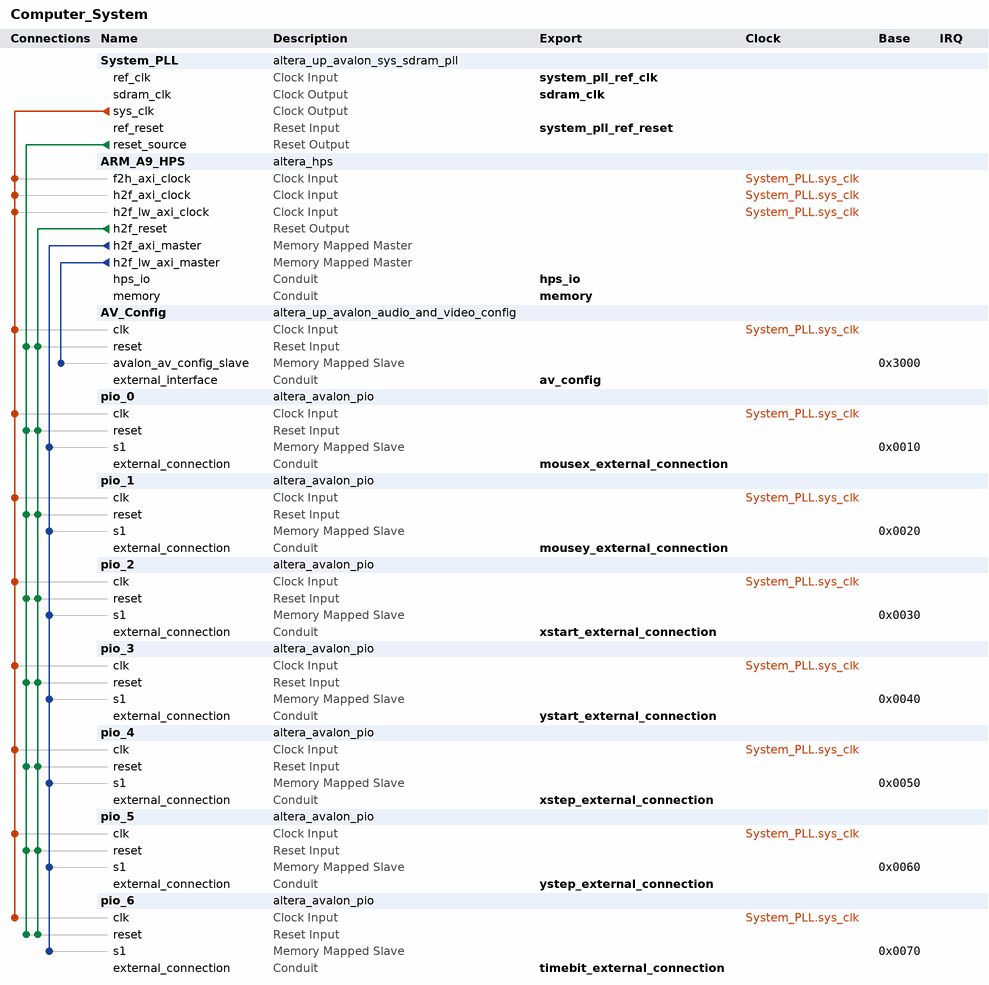
[diagram p0: system contents]
# Platform Designer (Qsys) system Computer_System, Cyclone V 5CSEMA5F31C6
# Parameters at their usual value, and those the tool derives, are not listed.
package require -exact qsys 15.0
create_system Computer_System
set_project_property DEVICE_FAMILY {Cyclone V}
set_project_property DEVICE 5CSEMA5F31C6

add_instance System_PLL altera_up_avalon_sys_sdram_pll 15.0
set_instance_parameter_value System_PLL CV_boards DE1-SoC
set_instance_parameter_value System_PLL gui_outclk 100.0
set_instance_parameter_value System_PLL gui_refclk 50.0

add_instance ARM_A9_HPS altera_hps 15.0
set_instance_parameter_value ARM_A9_HPS EMAC1_Mode RGMII
set_instance_parameter_value ARM_A9_HPS EMAC1_PinMuxing {HPS I/O Set 0}
set_instance_parameter_value ARM_A9_HPS F2SCLK_COLDRST_Enable false
set_instance_parameter_value ARM_A9_HPS F2SCLK_DBGRST_Enable false
set_instance_parameter_value ARM_A9_HPS F2SCLK_WARMRST_Enable false
set_instance_parameter_value ARM_A9_HPS F2SINTERRUPT_Enable true
set_instance_parameter_value ARM_A9_HPS F2S_Width 2
set_instance_parameter_value ARM_A9_HPS FPGA_PERIPHERAL_OUTPUT_CLOCK_FREQ_EMAC0_GTX_CLK 125
set_instance_parameter_value ARM_A9_HPS FPGA_PERIPHERAL_OUTPUT_CLOCK_FREQ_EMAC0_MD_CLK 100.0
set_instance_parameter_value ARM_A9_HPS FPGA_PERIPHERAL_OUTPUT_CLOCK_FREQ_EMAC1_GTX_CLK 125
set_instance_parameter_value ARM_A9_HPS FPGA_PERIPHERAL_OUTPUT_CLOCK_FREQ_EMAC1_MD_CLK 100.0
set_instance_parameter_value ARM_A9_HPS HPS_PROTOCOL DDR3
set_instance_parameter_value ARM_A9_HPS I2C0_Mode I2C
set_instance_parameter_value ARM_A9_HPS I2C0_PinMuxing {HPS I/O Set 0}
set_instance_parameter_value ARM_A9_HPS I2C1_Mode I2C
set_instance_parameter_value ARM_A9_HPS I2C1_PinMuxing {HPS I/O Set 0}
set_instance_parameter_value ARM_A9_HPS LWH2F_Enable true
set_instance_parameter_value ARM_A9_HPS MEM_BANKADDR_WIDTH 3
set_instance_parameter_value ARM_A9_HPS MEM_CLK_FREQ 400.0
set_instance_parameter_value ARM_A9_HPS MEM_COL_ADDR_WIDTH 10
set_instance_parameter_value ARM_A9_HPS MEM_DQ_WIDTH 32
set_instance_parameter_value ARM_A9_HPS MEM_DRV_STR RZQ/7
set_instance_parameter_value ARM_A9_HPS MEM_ROW_ADDR_WIDTH 15
set_instance_parameter_value ARM_A9_HPS MEM_RTT_NOM RZQ/4
set_instance_parameter_value ARM_A9_HPS MEM_RTT_WR RZQ/4
set_instance_parameter_value ARM_A9_HPS MEM_TCL 11
set_instance_parameter_value ARM_A9_HPS MEM_TFAW_NS 30.0
set_instance_parameter_value ARM_A9_HPS MEM_TRAS_NS 35.0
set_instance_parameter_value ARM_A9_HPS MEM_TRCD_NS 13.75
set_instance_parameter_value ARM_A9_HPS MEM_TRFC_NS 260.0
set_instance_parameter_value ARM_A9_HPS MEM_TRP_NS 13.75
set_instance_parameter_value ARM_A9_HPS MEM_VENDOR JEDEC
set_instance_parameter_value ARM_A9_HPS MEM_WTCL 8
set_instance_parameter_value ARM_A9_HPS QSPI_Mode {1 SS}
set_instance_parameter_value ARM_A9_HPS QSPI_PinMuxing {HPS I/O Set 0}
set_instance_parameter_value ARM_A9_HPS REF_CLK_FREQ 25.0
set_instance_parameter_value ARM_A9_HPS S2F_Width 3
set_instance_parameter_value ARM_A9_HPS SDIO_Mode {4-bit Data}
set_instance_parameter_value ARM_A9_HPS SDIO_PinMuxing {HPS I/O Set 0}
set_instance_parameter_value ARM_A9_HPS SPIM1_Mode {Single Slave Select}
set_instance_parameter_value ARM_A9_HPS SPIM1_PinMuxing {HPS I/O Set 0}
set_instance_parameter_value ARM_A9_HPS STM_Enable false
set_instance_parameter_value ARM_A9_HPS TIMING_BOARD_AC_SKEW 0.03
set_instance_parameter_value ARM_A9_HPS TIMING_BOARD_AC_TO_CK_SKEW 0.0
set_instance_parameter_value ARM_A9_HPS TIMING_BOARD_DQ_TO_DQS_SKEW 0.0
set_instance_parameter_value ARM_A9_HPS TIMING_BOARD_MAX_CK_DELAY 0.03
set_instance_parameter_value ARM_A9_HPS TIMING_BOARD_MAX_DQS_DELAY 0.02
set_instance_parameter_value ARM_A9_HPS TIMING_BOARD_SKEW_BETWEEN_DQS 0.08
set_instance_parameter_value ARM_A9_HPS TIMING_BOARD_SKEW_CKDQS_DIMM_MAX 0.16
set_instance_parameter_value ARM_A9_HPS TIMING_BOARD_SKEW_CKDQS_DIMM_MIN 0.09
set_instance_parameter_value ARM_A9_HPS TIMING_BOARD_SKEW_WITHIN_DQS 0.01
set_instance_parameter_value ARM_A9_HPS TIMING_TDH 65
set_instance_parameter_value ARM_A9_HPS TIMING_TDQSCK 255
set_instance_parameter_value ARM_A9_HPS TIMING_TDQSQ 125
set_instance_parameter_value ARM_A9_HPS TIMING_TDS 30
set_instance_parameter_value ARM_A9_HPS TIMING_TIH 140
set_instance_parameter_value ARM_A9_HPS TIMING_TIS 180
set_instance_parameter_value ARM_A9_HPS TIMING_TQSH 0.4
set_instance_parameter_value ARM_A9_HPS UART0_Mode {No Flow Control}
set_instance_parameter_value ARM_A9_HPS UART0_PinMuxing {HPS I/O Set 0}
set_instance_parameter_value ARM_A9_HPS USB1_Mode SDR
set_instance_parameter_value ARM_A9_HPS USB1_PinMuxing {HPS I/O Set 0}
set_instance_parameter_value ARM_A9_HPS desired_cfg_clk_mhz 100.0
set_instance_parameter_value ARM_A9_HPS desired_qspi_clk_mhz 400.0

add_instance AV_Config altera_up_avalon_audio_and_video_config 15.0
set_instance_parameter_value AV_Config audio_in {Microphone to ADC}
set_instance_parameter_value AV_Config bit_length 32
set_instance_parameter_value AV_Config board DE1-SoC
set_instance_parameter_value AV_Config line_in_bypass false
set_instance_parameter_value AV_Config sampling_rate {48 kHz}

add_instance pio_0 altera_avalon_pio 15.0
set_instance_parameter_value pio_0 direction Output
set_instance_parameter_value pio_0 resetValue 319
set_instance_parameter_value pio_0 width 10

add_instance pio_1 altera_avalon_pio 15.0
set_instance_parameter_value pio_1 direction Output
set_instance_parameter_value pio_1 resetValue 239
set_instance_parameter_value pio_1 width 10

add_instance pio_2 altera_avalon_pio 15.0
set_instance_parameter_value pio_2 direction Output
set_instance_parameter_value pio_2 resetValue 117440512
set_instance_parameter_value pio_2 width 27

add_instance pio_3 altera_avalon_pio 15.0
set_instance_parameter_value pio_3 direction Output
set_instance_parameter_value pio_3 resetValue 125829120
set_instance_parameter_value pio_3 width 27

add_instance pio_4 altera_avalon_pio 15.0
set_instance_parameter_value pio_4 direction Output
set_instance_parameter_value pio_4 resetValue 39383
set_instance_parameter_value pio_4 width 27

add_instance pio_5 altera_avalon_pio 15.0
set_instance_parameter_value pio_5 direction Output
set_instance_parameter_value pio_5 resetValue 35025
set_instance_parameter_value pio_5 width 27

add_instance pio_6 altera_avalon_pio 15.0
set_instance_parameter_value pio_6 direction Input
set_instance_parameter_value pio_6 width 1

# connections
add_connection System_PLL.sys_clk ARM_A9_HPS.f2h_axi_clock clock
add_connection System_PLL.sys_clk ARM_A9_HPS.h2f_axi_clock clock
add_connection System_PLL.sys_clk ARM_A9_HPS.h2f_lw_axi_clock clock
add_connection System_PLL.sys_clk AV_Config.clk clock
add_connection System_PLL.sys_clk pio_0.clk clock
add_connection System_PLL.sys_clk pio_1.clk clock
add_connection System_PLL.sys_clk pio_2.clk clock
add_connection System_PLL.sys_clk pio_3.clk clock
add_connection System_PLL.sys_clk pio_4.clk clock
add_connection System_PLL.sys_clk pio_5.clk clock
add_connection System_PLL.sys_clk pio_6.clk clock
add_connection ARM_A9_HPS.h2f_reset AV_Config.reset reset
add_connection ARM_A9_HPS.h2f_reset pio_0.reset reset
add_connection ARM_A9_HPS.h2f_reset pio_1.reset reset
add_connection ARM_A9_HPS.h2f_reset pio_2.reset reset
add_connection ARM_A9_HPS.h2f_reset pio_3.reset reset
add_connection ARM_A9_HPS.h2f_reset pio_4.reset reset
add_connection ARM_A9_HPS.h2f_reset pio_5.reset reset
add_connection ARM_A9_HPS.h2f_reset pio_6.reset reset
add_connection System_PLL.reset_source AV_Config.reset reset
add_connection System_PLL.reset_source pio_0.reset reset
add_connection System_PLL.reset_source pio_1.reset reset
add_connection System_PLL.reset_source pio_2.reset reset
add_connection System_PLL.reset_source pio_3.reset reset
add_connection System_PLL.reset_source pio_4.reset reset
add_connection System_PLL.reset_source pio_5.reset reset
add_connection System_PLL.reset_source pio_6.reset reset
add_connection ARM_A9_HPS.h2f_axi_master pio_0.s1 avalon
set_connection_parameter_value ARM_A9_HPS.h2f_axi_master/pio_0.s1 baseAddress 0x0010
add_connection ARM_A9_HPS.h2f_axi_master pio_1.s1 avalon
set_connection_parameter_value ARM_A9_HPS.h2f_axi_master/pio_1.s1 baseAddress 0x0020
add_connection ARM_A9_HPS.h2f_axi_master pio_2.s1 avalon
set_connection_parameter_value ARM_A9_HPS.h2f_axi_master/pio_2.s1 baseAddress 0x0030
add_connection ARM_A9_HPS.h2f_axi_master pio_3.s1 avalon
set_connection_parameter_value ARM_A9_HPS.h2f_axi_master/pio_3.s1 baseAddress 0x0040
add_connection ARM_A9_HPS.h2f_axi_master pio_4.s1 avalon
set_connection_parameter_value ARM_A9_HPS.h2f_axi_master/pio_4.s1 baseAddress 0x0050
add_connection ARM_A9_HPS.h2f_axi_master pio_5.s1 avalon
set_connection_parameter_value ARM_A9_HPS.h2f_axi_master/pio_5.s1 baseAddress 0x0060
add_connection ARM_A9_HPS.h2f_axi_master pio_6.s1 avalon
set_connection_parameter_value ARM_A9_HPS.h2f_axi_master/pio_6.s1 baseAddress 0x0070
add_connection ARM_A9_HPS.h2f_lw_axi_master AV_Config.avalon_av_config_slave avalon
set_connection_parameter_value ARM_A9_HPS.h2f_lw_axi_master/AV_Config.avalon_av_config_slave baseAddress 0x3000

# exported interfaces
add_interface av_config conduit end
set_interface_property av_config EXPORT_OF AV_Config.external_interface
add_interface hps_io conduit end
set_interface_property hps_io EXPORT_OF ARM_A9_HPS.hps_io
add_interface memory conduit end
set_interface_property memory EXPORT_OF ARM_A9_HPS.memory
add_interface mousex_external_connection conduit end
set_interface_property mousex_external_connection EXPORT_OF pio_0.external_connection
add_interface mousey_external_connection conduit end
set_interface_property mousey_external_connection EXPORT_OF pio_1.external_connection
add_interface sdram_clk clock source
set_interface_property sdram_clk EXPORT_OF System_PLL.sdram_clk
add_interface system_pll_ref_clk clock sink
set_interface_property system_pll_ref_clk EXPORT_OF System_PLL.ref_clk
add_interface system_pll_ref_reset reset sink
set_interface_property system_pll_ref_reset EXPORT_OF System_PLL.ref_reset
add_interface timebit_external_connection conduit end
set_interface_property timebit_external_connection EXPORT_OF pio_6.external_connection
add_interface xstart_external_connection conduit end
set_interface_property xstart_external_connection EXPORT_OF pio_2.external_connection
add_interface xstep_external_connection conduit end
set_interface_property xstep_external_connection EXPORT_OF pio_4.external_connection
add_interface ystart_external_connection conduit end
set_interface_property ystart_external_connection EXPORT_OF pio_3.external_connection
add_interface ystep_external_connection conduit end
set_interface_property ystep_external_connection EXPORT_OF pio_5.external_connection

set_interconnect_requirement {$system} qsys_mm.clockCrossingAdapter HANDSHAKE
set_interconnect_requirement {$system} qsys_mm.enableEccProtection FALSE
set_interconnect_requirement {$system} qsys_mm.insertDefaultSlave FALSE
set_interconnect_requirement {$system} qsys_mm.maxAdditionalLatency 1

save_system Computer_System.qsys
